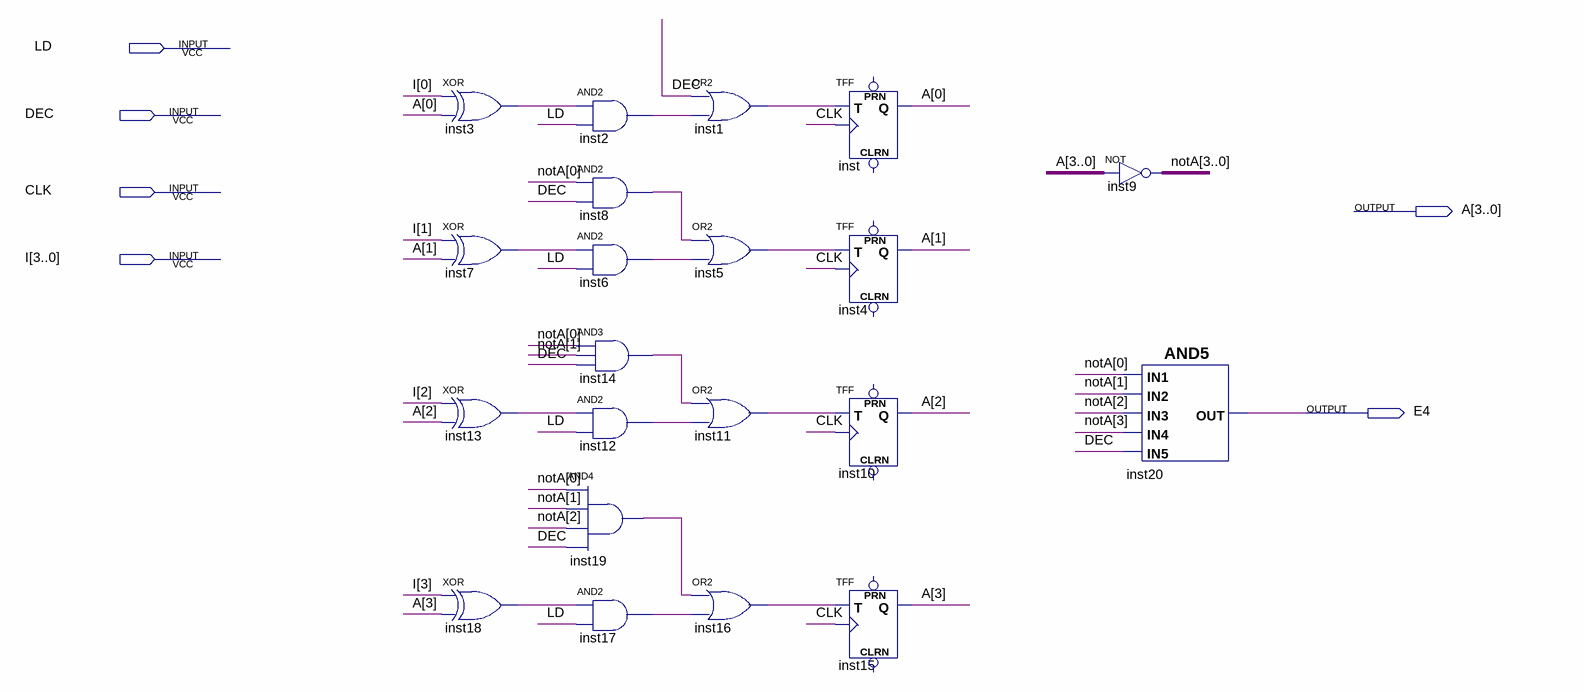
[diagram p0: schematic sheet]
// Quartus schematic REG4_LD_DEC.bdf as structural Verilog: 21 symbols, 6 pins
module REG4_LD_DEC (
  input  LD,
  input  DEC,
  input  CLK,
  input  [3:0] I,
  output [3:0] A,
  output E4
);

  wire inst1_out, inst2_out, inst3_out, inst5_out, inst6_out, inst7_out, inst8_out, inst11_out, inst12_out,
       inst13_out, inst14_out, inst16_out, inst17_out, inst18_out, inst19_out;
  wire [3:0] notA;

  xor inst3 (inst3_out, I[0], A[0]);
  xor inst7 (inst7_out, I[1], A[1]);
  xor inst13 (inst13_out, I[2], A[2]);
  xor inst18 (inst18_out, I[3], A[3]);
  and inst2 (inst2_out, inst3_out, LD);
  and inst8 (inst8_out, notA[0], DEC);
  and inst6 (inst6_out, inst7_out, LD);
  and inst14 (inst14_out, notA[0], notA[1], DEC);
  and inst12 (inst12_out, inst13_out, LD);
  and inst19 (inst19_out, notA[0], notA[1], notA[2], DEC);
  and inst17 (inst17_out, inst18_out, LD);
  or inst1 (inst1_out, DEC, inst2_out);
  or inst5 (inst5_out, inst8_out, inst6_out);
  or inst11 (inst11_out, inst14_out, inst12_out);
  or inst16 (inst16_out, inst19_out, inst17_out);
  TFF inst (.T(inst1_out), .CLK(CLK), .Q(A[0]));  // open: PRN, CLRN
  TFF inst4 (.T(inst5_out), .CLK(CLK), .Q(A[1]));  // open: PRN, CLRN
  TFF inst10 (.T(inst11_out), .CLK(CLK), .Q(A[2]));  // open: PRN, CLRN
  TFF inst15 (.T(inst16_out), .CLK(CLK), .Q(A[3]));  // open: PRN, CLRN
  assign notA = ~A;  // NOT inst9, 4 bits wide
  and inst20 (E4, notA[0], notA[1], notA[2], notA[3], DEC);
endmodule
